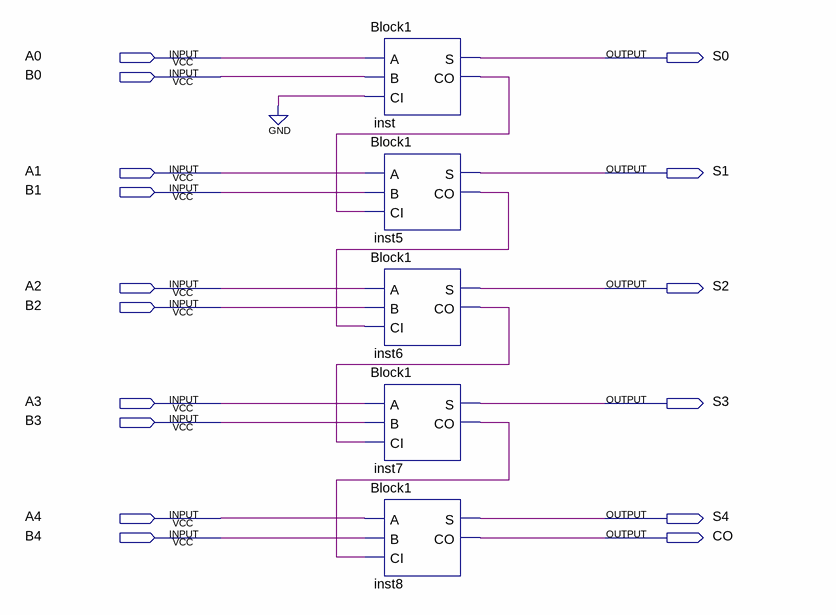
[diagram p0: schematic sheet]
// Quartus schematic Add5Bin.bdf as structural Verilog: 5 symbols, 16 pins
module Add5Bin (
  input  A0,
  input  B0,
  input  A1,
  input  B1,
  input  A2,
  input  B2,
  input  A3,
  input  B3,
  input  A4,
  input  B4,
  output S0,
  output S1,
  output S2,
  output S3,
  output S4,
  output CO
);

  wire inst5_co, inst6_co, inst7_co, inst_co;

  Block1 inst (.A(A0), .B(B0), .CI(1'b0), .S(S0), .CO(inst_co));
  Block1 inst5 (.A(A1), .B(B1), .CI(inst_co), .S(S1), .CO(inst5_co));
  Block1 inst6 (.A(A2), .B(B2), .CI(inst5_co), .S(S2), .CO(inst6_co));
  Block1 inst7 (.A(A3), .B(B3), .CI(inst6_co), .S(S3), .CO(inst7_co));
  Block1 inst8 (.A(A4), .B(B4), .CI(inst7_co), .S(S4), .CO(CO));
endmodule
